# Altium project Read Time sensor Tho AMT.PrjPcb
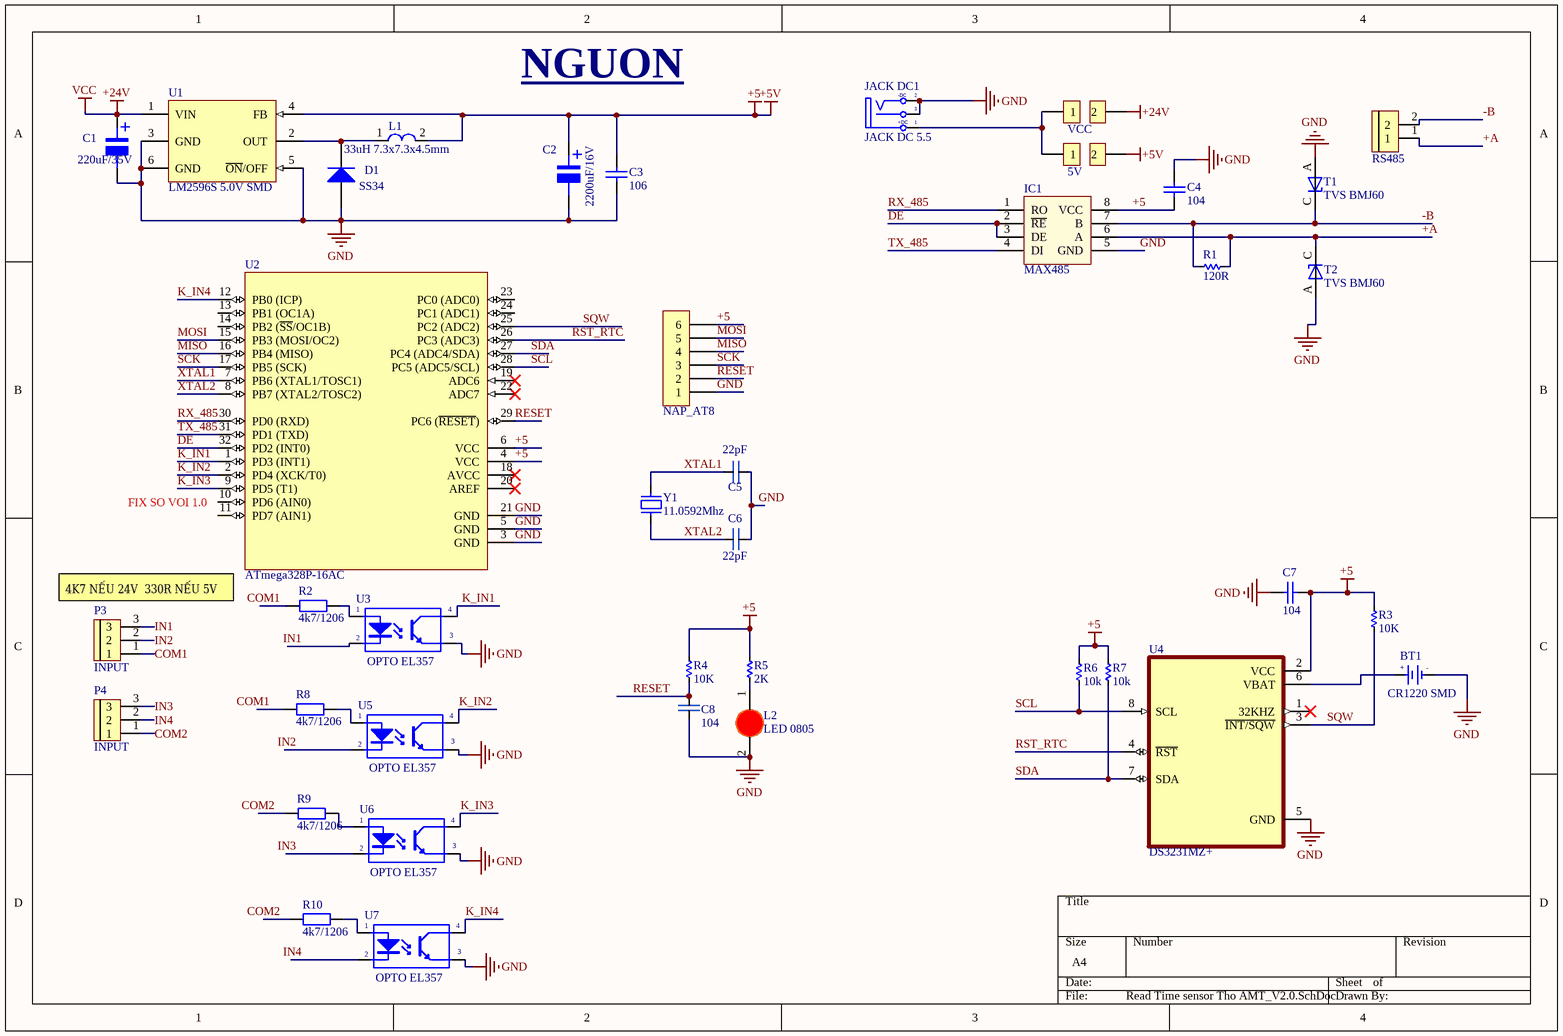
[diagram p0: Read Time sensor Tho AMT_V2.0.SchDoc]
1 sheet, 40 parts. Net scope: global (net labels, ports and power ports of the same name join across sheets).
Board file: Read Time sensor Tho AMT_V2.0.PcbDoc

## Sheet Read Time sensor Tho AMT_V2.0.SchDoc
size A4; SheetNumber: 1; SheetTotal: 1

### Parts
BT1  CR1220 SMD  [DE PIN CR1220]
C1  220uF/35V  [tu nhom 10 (g)]
C2  2200uF/16V  [tu nhom 6.3 (d)]
C3  106  [tu 0805]
C4  104  [TU 0805]
C5  22pF  [TU 0805]
C6  22pF  [TU 0805]
C7  104  [TU 0805]
C8  104  [TU 0805]
D1  SS34  [DIODE SMA]
EDG_1  RS485  [CON 2 2EDG5.08]
H1  NAP_AT8  [Header 6P DC 2.54]
IC1  MAX485  [SO8]
JACK_DC1  JACK DC 5.5  [JACK DC 5.5]
L1  33uH 7.3x7.3x4.5mm  [L-SMD-M-7.3x4.5]
L2  LED 0805  [LED-0805-Red]
P1  VCC  [SMT-0805-RES]
P2  5V  [SMT-0805-RES]
P3  INPUT  [CON 3 3EDG5.08]
P4  INPUT  [CON 3 3EDG5.08]
R1  120R  [RES-SMD-0805]
R2  4k7/1206  [tro smd 1206]
R3  10K  [RES-SMD-0805]
R4  10K  [RES-SMD-0805]
R5  2K  [RES-SMD-0805]
R6  10k  [RES-SMD-0805]
R7  10k  [RES-SMD-0805]
R8  4k7/1206  [tro smd 1206]
R9  4k7/1206  [tro smd 1206]
R10  4k7/1206  [tro smd 1206]
T1  TVS BMJ60  [TVS BMJ60]
T2  TVS BMJ60  [TVS BMJ60]
U1  LM2596S 5.0V SMD  [TO263-5]
U2  ATmega328P-16AC  [32A_N]
U3  OPTO EL357  [OPTO EL354]
U4  DS3231MZ+  [SOIC-8]
U5  OPTO EL357  [OPTO EL354]
U6  OPTO EL357  [OPTO EL354]
U7  OPTO EL357  [OPTO EL354]
Y1  11.0592Mhz  [Thach Anh 2 chan SMD5032]

### Nets
+5: C2.1 C3.2 C4.1 C7.1 H1.6 IC1.8(VCC) L1.2 P2.2 R3.1 R4.2 R5.1 R6.1 R7.1 U1.4(FB) U2.4(VCC) U2.6(VCC) U4.2(VCC)  [also labelled +5V]
+24V: C1.1 P1.2 U1.1(VIN)  [also labelled VCC]
GND: BT1.2(GND) C1.2 C2.2 C3.1 C4.2 C5.2 C6.2 C7.2 C8.2 D1.1(A) H1.1 IC1.5(GND) JACK_DC1.2(TN) JACK_DC1.3(S) L2.2(K) T1.A T2.A U1.3(GND) U1.5(~{ON}/OFF) U1.6(GND) U2.3(GND) U2.5(GND) U2.21(GND) U3.3(E) U4.5(GND) U5.3(E) U6.3(E) U7.3(E)
+A: EDG_1.1 IC1.6(A) R1.2 T2.C
-B: EDG_1.2 IC1.7(B) R1.1 T1.C
COM1: P3.1 R2.1 R8.1
COM2: P4.1 R9.1 R10.1
DE: IC1.2(~{RE}) IC1.3(DE) U2.32(PD2_(INT0))
IN1: P3.3 U3.2(K)
IN2: P3.2 U5.2(K)
IN3: P4.3 U6.2(K)
IN4: P4.2 U7.2(K)
K_IN1: U2.1(PD3_(INT1)) U3.4(C)
K_IN2: U2.2(PD4_(XCK/T0)) U5.4(C)
K_IN3: U2.9(PD5_(T1)) U6.4(C)
K_IN4: U2.12(PB0_(ICP)) U7.4(C)
MISO: H1.4 U2.16(PB4_(MISO))
MOSI: H1.5 U2.15(PB3_(MOSI/OC2))
RESET: C8.1 H1.2 R4.1 U2.29(PC6_(~{RESET}))
RST_RTC: U2.26(PC3_(ADC3)) U4.4(~{RST})
RX_485: IC1.1(RO) U2.30(PD0_(RXD))
SCK: H1.3 U2.17(PB5_(SCK))
SCL: R6.2 U2.28(PC5_(ADC5/SCL)) U4.8(SCL)
SDA: R7.2 U2.27(PC4_(ADC4/SDA)) U4.7(SDA)
SQW: R3.2 U2.25(PC2_(ADC2)) U4.3(~{INT/SQW})
TX_485: IC1.4(DI) U2.31(PD1_(TXD))
XTAL1: C5.1 U2.7(PB6_(XTAL1/TOSC1)) Y1.2
XTAL2: C6.1 U2.8(PB7_(XTAL2/TOSC2)) Y1.1
NetBT1_1: BT1.1(+3V) U4.6(VBAT)
NetD1_2: D1.2(K) L1.1 U1.2(OUT)
NetJACK_DC1_1: JACK_DC1.1(T) P1.1 P2.1
NetL2_1: L2.1(A) R5.2
NetR2_2: R2.2 U3.1(A)
NetR8_2: R8.2 U5.1(A)
NetR9_2: R9.2 U6.1(A)
NetR10_2: R10.2 U7.1(A)

Not connected (* = marked no-connect by the designer): U2 10(PD6_(AIN0)) 11(PD7_(AIN1)) 13(PB1_(OC1A)) 14(PB2_(~{SS}/OC1B)) 18(AVCC)* 19(ADC6)* 20(AREF)* 22(ADC7)* 23(PC0_(ADC0)) 24(PC1_(ADC1)); U4 1(32KHZ)*

### Notes on the sheet
- NGUON
- (near U2) FIX SO VOI 1.0
- 4K7 NẾU 24V  330R NẾU 5V
- (in symbol De pin CR1220 SMD) +; -
- (in symbol JACK DC 5.5) -DC; +DC
- (in symbol Tu Nhom 10uF 20V) +
- (in symbol Tu Nhom 220uF 50V) +

### Library data of the parts
BT1 = De pin CR1220 SMD: Ten: Đế PIN CR1220 SMD; Ma_Hang: MH000833
C1 = Tu Nhom 220uF 50V: Dán 35V; Don_Vi: Con; So_Chan: 2; Ten_Linh_Kien: Tụ Nhôm 220uF 50V 10x10.2MM; Ma_Hang: MH002228; Chung_Loai: Dán; Kieu_Chan: *
C2 = Tu Nhom 10uF 20V: Dán; Don_Vi: Con; So_Chan: 2; Ten_Linh_Kien: Tụ Nhôm 10uF 20V; Ma_Hang: MH004016; Chung_Loai: Dán; Kieu_Chan: *
C3 = Tu 0805 105 50V 10%: Dán; Don_Vi: Con; So_Chan: 2; Ten_Linh_Kien: Tụ 0805 105-1uF 10% 50V; Ma_Hang: MH004552; Chung_Loai: Dán; Kieu_Chan: *
C4 C7 = Tu 0805 104 50V 10%: Dán; Don_Vi: Con; So_Chan: 2; Ten_Linh_Kien: Tụ 0805 104-100nF 10% 50V; Ma_Hang: MH004551; Chung_Loai: Dán; Kieu_Chan: *
C5 C6 C8 = TU 0805
D1 = Diode SS14 ( 1N5819): Dán; Ma_Hang: MH002211; Don_Vi: Con; Ten_Linh_Kien: Diode SS14 DO214 Schottky 1A 40V ( 1N5819 DO214); Chung_Loai: Dán; Ghi_Chu: *; Kieu_Chan: *
EDG_1 = CON 2 EDG5.08: Cắm; Ten_Linh_Kien: CON 2 2EDG5.08-2P 5.08MM ( Xanh Cong); Don_Vi: Con; Ma_Hang: MH000759; Ghi_Chu: *; Kieu_Chan: *; Chung_Loai: Cắm
H1 = Header 6P 2.54 Duc Cong: Cắm; Ten_Linh_Kien: Header 6P XH2.54-6P Đực Cong; Don_Vi: Con; Ma_Hang: MH003363; Chung_Loai: Cắm
IC1 = MAX485: RS232 - RS485 (Same sn75176)
JACK_DC1 = JACK DC 5.5: Value: Jac DC
L1 = L-SMD-1: partNo: 78477010; Manufacturer: Wurth Elektronik; Inductance: 1.0 μH; ComponentLink1Description: Manufacturer; ComponentLink1URL: http://www.we-online.de; Created by: Baojun Chen; Created Date: Nov.2015; ComponentLink2Description: Datasheet; ComponentLink2URL: http://katalog.we-online.de/pbs/datasheet/78477010.pdf
L2 = LED 0805 Do: Dán; Don_Vi: Con; Ma_Hang: MH000897; Ten_Linh_Kien: LED 0805 Màu Đỏ (Red); Ghi_Chu: *; Kieu_Chan: *; Chung_Loai: Dán
P1 P2 = Pad han noi 2 duong
P3 P4 = CON 3 EDG5.08: Cắm; Ten_Linh_Kien: CON 3 2EDG5.08-3P 5.08MM ( Xanh Cong); Don_Vi: Con; Ma_Hang: MH000760; Ghi_Chu: *; Kieu_Chan: *; Chung_Loai: Cắm
R1 R3-R7 = Res-SMD: Resistor; Manufacturer: Generic Components; Class: Passive; Published: 08/06/2000; Publisher: Altium Hobart Technology Centre
R2 R8-R10 = Tro 0805 5% 10k: Dán; Don_Vi: Con; So_Chan: 2; Ten_Linh_Kien: Trở 0805 5% 10k; Ma_Hang: MH005239; Chung_Loai: Dán; Kieu_Chan: *
U1 = LM2576HVS 5.0V SMD: Dán; Ten_Linh_Kien: LM2576HVS-5.0V BUCK 5V 3A TO263-5; Don_Vi: Con; Ma_Hang: MH002362; Ghi_Chu: *; Kieu_Chan: *; Chung_Loai: Dán
U2 = ATmega8-16AC: 8-Bit AVR Microcontroller with 8K Bytes of In-System Programmable Flash Memory; Published: 17-Sep-2003; LatestRevisionDate: 16-Oct-2006; LatestRevisionNote: IPC-7351 Footprint Added.; DatasheetVersion: 2486H-AVR-09/02; PackageVersion: revB, Oct-2001; PackageReference: 32A; Publisher: Altium Limited; PackageDescription: 32-Lead, 7x7x1.0 mm Body, 0.8mm Lead Pitch, Thin Profile Plastic Quad Flat Package (TQFP); Supplier 1: Digi-Key; Supplier Part Number 1: ATMEGA8-16AC-ND; Supplier 2: Mouser; Supplier Part Number 2: 556-ATMEGA8-16AC; Code_JEDEC: MS-026-ABA; ComponentLink1Description: Datasheet; ComponentLink1URL: http://www.atmel.com/dyn/resources/prod_documents/doc2486.pdf; ComponentLink2Description: Atmel.com Home; ComponentLink2URL: http://www.atmel.com
U3 U5-U7 = OPTO PC817 SMD: Single Opto; Value: PC817
U4 = DS3231MZ+: MF: Analog Devices; SnapEDA_Link: https://www.snapeda.com/parts/DS3231MZ+/Analog+Devices/view-part/?ref=snap; Package: SOIC-8 Maxim; Value: *; MP: DS3231MZ+; Check_prices: https://www.snapeda.com/parts/DS3231MZ+/Analog+Devices/view-part/?ref=eda
Y1 = Thach Anh 2 chan SMD 5032: Crystal For all Crystal 2pin.; Value: 4Mhz